# Altium schematic sheet Wacky_Racers_87557913.SchDoc
size A3; Address1: ECE Department; Address2: University of Canterbury; Address3: Christchurch 8041; Address4: New Zealand; Revision: 1; ImagePath: \\maxwell\elecapp\AltiumDesigner\Templates\uc-logo.png
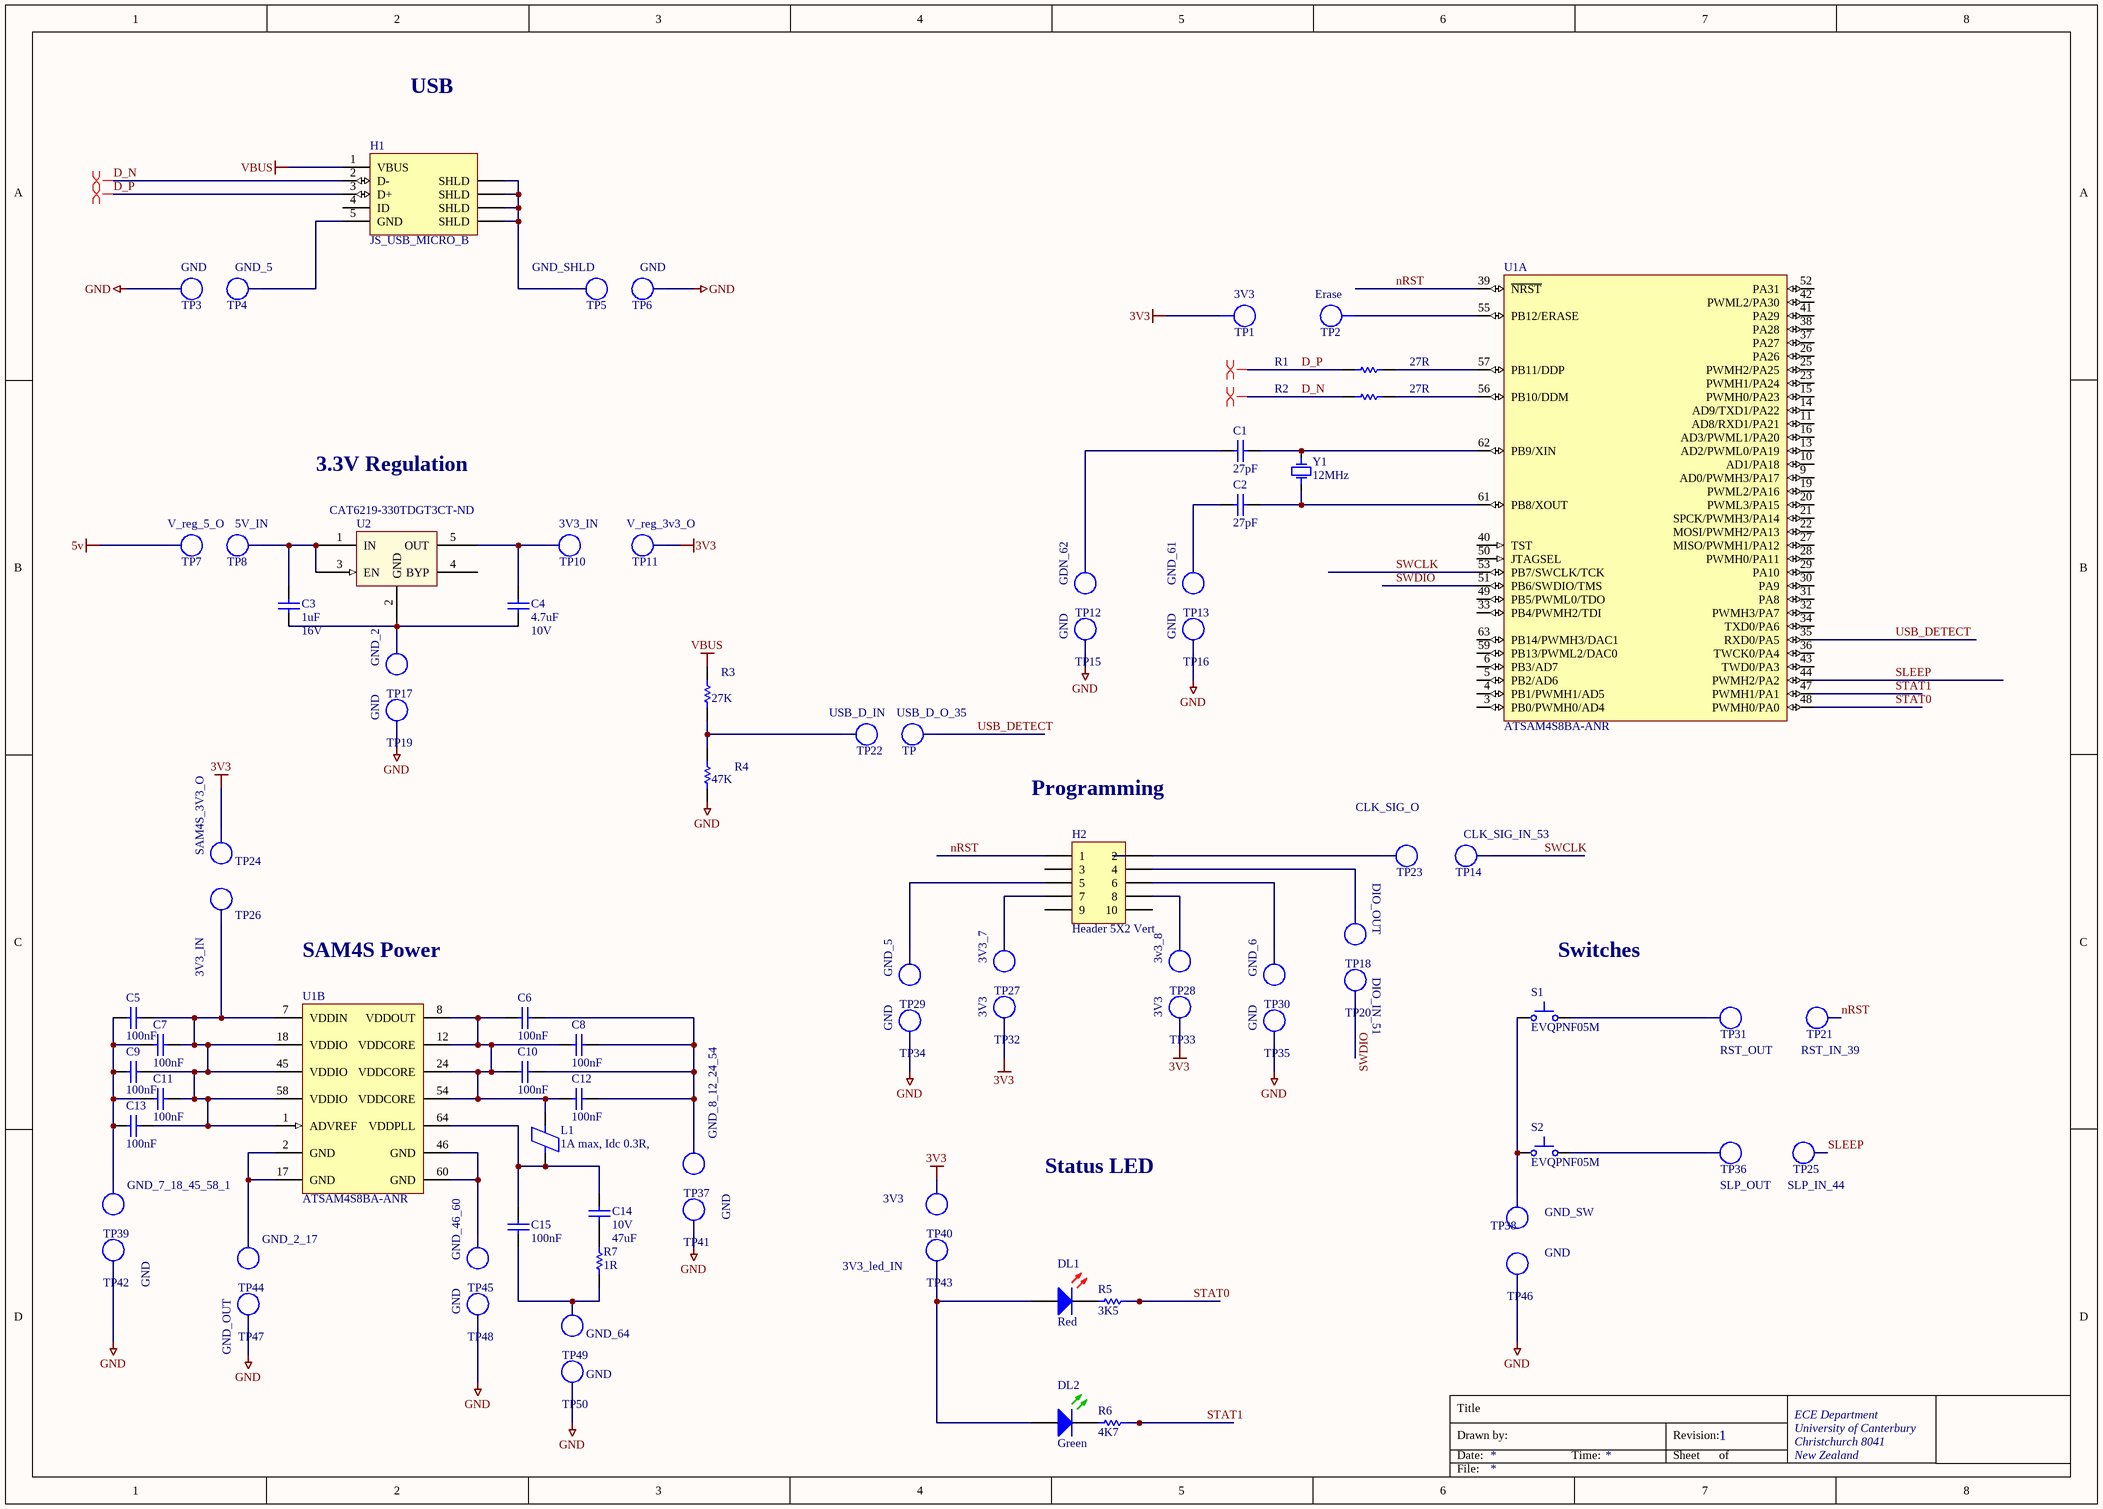
[diagram p0: Wacky_Racers_87557913.SchDoc]

## Parts
C1  27pF  [CAPC1608L]
C2  27pF  [CAPC1608L]
C3  Max Voltage: 16V  [CAPC1608L]  (hidden comment: 1uF)
C4  Max Voltage: 10V  [CAPC1608N]  (hidden comment: 4.7uF)
C5  100nF  [CAPC1608L]
C6  100nF  [CAPC1608L]
C7  100nF  [CAPC1608L]
C8  100nF  [CAPC1608L]
C9  100nF  [CAPC1608L]
C10  100nF  [CAPC1608L]
C11  100nF  [CAPC1608L]
C12  100nF  [CAPC1608L]
C13  100nF  [CAPC1608L]
C14  Max Voltage: 10V  [CAPC3216L]  (hidden comment: 47uF)
C15  100nF  [CAPC1608L]
DL1  Red  [WL-SMCW0603]
DL2  Green  [WL-SMCW0603]
H1  JS_USB_MICRO_B  [FCI_USB_10118194-0001LF]
H2  Header 5X2 Vert  [IDC2.54-V10D]
L1  1A max, Idc 0.3R,  [INDC3216L]
R1  27R  [RESC1608L]
R2  27R  [RESC1608L]
R3  27K  [RESC1608L]
R4  47K  [RESC1608N]
R5  3K5  [RESC1608L]
R6  4K7  [RESC1608L]
R7  1R  [RESC3216L]
S1  EVQPNF05M  [EVQPNF05M]
S2  EVQPNF05M  [EVQPNF05M]
TP  TP_0603  [TP_0603]  (value not drawn)
TP1  TP  [TP_1206]  (value not drawn)  (no BOM)
TP2  TP  [TP_1206]  (value not drawn)  (no BOM)
TP3  TP_0603  [TP_0603]  (value not drawn)
TP4  TP_0603  [TP_0603]  (value not drawn)
TP5  TP_0603  [TP_0603]  (value not drawn)
TP6  TP_0603  [TP_0603]  (value not drawn)
TP7  TP_0603  [TP_0603]  (value not drawn)
TP8  TP_0603  [TP_0603]  (value not drawn)
TP10  TP_0603  [TP_0603]  (value not drawn)
TP11  TP_0603  [TP_0603]  (value not drawn)
TP12  TP_0603  [TP_0603]  (value not drawn)
TP13  TP_0603  [TP_0603]  (value not drawn)
TP14  TP_0603  [TP_0603]  (value not drawn)
TP15  TP_0603  [TP_0603]  (value not drawn)
TP16  TP_0603  [TP_0603]  (value not drawn)
TP17  TP_0603  [TP_0603]  (value not drawn)
TP18  TP_0603  [TP_0603]  (value not drawn)
TP19  TP_0603  [TP_0603]  (value not drawn)
TP20  TP_0603  [TP_0603]  (value not drawn)
TP21  TP_0603  [TP_0603]  (value not drawn)
TP22  TP_0603  [TP_0603]  (value not drawn)
TP23  TP_0603  [TP_0603]  (value not drawn)
TP24  TP_0603  [TP_0603]  (value not drawn)
TP25  TP_0603  [TP_0603]  (value not drawn)
TP26  TP_0603  [TP_0603]  (value not drawn)
TP27  TP_0603  [TP_0603]  (value not drawn)
TP28  TP_0603  [TP_0603]  (value not drawn)
TP29  TP_0603  [TP_0603]  (value not drawn)
TP30  TP_0603  [TP_0603]  (value not drawn)
TP31  TP_0603  [TP_0603]  (value not drawn)
TP32  TP_0603  [TP_0603]  (value not drawn)
TP33  TP_0603  [TP_0603]  (value not drawn)
TP34  TP_0603  [TP_0603]  (value not drawn)
TP35  TP_0603  [TP_0603]  (value not drawn)
TP36  TP_0603  [TP_0603]  (value not drawn)
TP37  TP_0603  [TP_0603]  (value not drawn)
TP38  TP_0603  [TP_0603]  (value not drawn)
TP39  TP_0603  [TP_0603]  (value not drawn)
TP40  TP_0603  [TP_0603]  (value not drawn)
TP41  TP_0603  [TP_0603]  (value not drawn)
TP42  TP_0603  [TP_0603]  (value not drawn)
TP43  TP_0603  [TP_0603]  (value not drawn)
TP44  TP_0603  [TP_0603]  (value not drawn)
TP45  TP_0603  [TP_0603]  (value not drawn)
TP46  TP_0603  [TP_0603]  (value not drawn)
TP47  TP_0603  [TP_0603]  (value not drawn)
TP48  TP_0603  [TP_0603]  (value not drawn)
TP49  TP_0603  [TP_0603]  (value not drawn)
TP50  TP_0603  [TP_0603]  (value not drawn)
U1  ATSAM4S8BA-ANR  [LQFP64_L]  (parts A,B of 2)
U2  Supplier Part Number: CAT6219-330TDGT3CT-ND  [SOT95P280X145-5N]  (hidden comment: CAT6219-330TDGT3)
Y1  12MHz  [6.0X3.5-4]

## Nets
3V3: TP1.1 TP11.1(TP) TP24.1(TP) TP32.1(TP) TP33.1(TP) TP40.1(TP)
5v: TP7.1(TP)
GND: R4.1 TP3.1(TP) TP6.1(TP) TP15.1(TP) TP16.1(TP) TP19.1(TP) TP34.1(TP) TP35.1(TP) TP41.1(TP) TP42.1(TP) TP46.1(TP) TP47.1(TP) TP48.1(TP) TP50.1(TP)
VBUS: H1.1(VBUS) R3.2
D_N: H1.2(D-) R2.1
D_P: H1.3(D+) R1.1
nRST: H2.1 TP21.1(TP) U1.39(~{NRST})
SLEEP: TP25.1(TP) U1.44(PWMH2/PA2)
STAT0: R5.2 U1.48(PWMH0/PA0)
STAT1: R6.2 U1.47(PWMH1/PA1)
SWCLK: TP14.1(TP) U1.53(PB7/SWCLK/TCK)
SWDIO: TP20.1(TP) U1.51(PB6/SWDIO/TMS)
USB_DETECT: TP.1(TP) U1.35(RXD0/PA5)
NetC1_1: C1.1 TP12.1(TP)
NetC1_2: C1.2 U1.62(PB9/XIN) Y1.3(OSC2)
NetC2_1: C2.1 TP13.1(TP)
NetC2_2: C2.2 U1.61(PB8/XOUT) Y1.1(OSC1)
NetC3_1: C3.1 C4.1 TP17.1(TP) U2.2(GND)
NetC3_2: C3.2 TP8.1(TP) U2.1(IN) U2.3(EN)
NetC4_2: C4.2 TP10.1(TP) U2.5(OUT)
NetC5_1: C5.1 C7.1 C9.1 C11.1 C13.2 TP39.1(TP)
NetC5_2: C5.2 C7.2 C9.2 C11.2 C13.1 TP26.1(TP) U1.1(ADVREF) U1.7(VDDIN) U1.18(VDDIO) U1.45(VDDIO) U1.58(VDDIO)
NetC6_1: C6.1 C8.1 C10.1 C12.1 L1.2 U1.8(VDDOUT) U1.12(VDDCORE) U1.24(VDDCORE) U1.54(VDDCORE)
NetC6_2: C6.2 C8.2 C10.2 C12.2 TP37.1(TP)
NetC14_1: C14.1 R7.2
NetC14_2: C14.2 C15.2 L1.1 U1.64(VDDPLL)
NetC15_1: C15.1 R7.1 TP49.1(TP)
NetDL1_2: DL1.2(A) DL2.2(A) TP43.1(TP)
NetH1_5: H1.5(GND) TP4.1(TP)
NetH1_6: H1.6(SHLD) TP5.1(TP)
NetH2_2: H2.2 TP23.1(TP)
NetH2_4: H2.4 TP18.1(TP)
NetH2_5: H2.5 TP29.1(TP)
NetH2_6: H2.6 TP30.1(TP)
NetH2_7: H2.7 TP27.1(TP)
NetH2_8: H2.8 TP28.1(TP)
NetR1_2: R1.2 U1.57(PB11/DDP)
NetR2_2: R2.2 U1.56(PB10/DDM)
NetR3_1: R3.1 R4.2 TP22.1(TP)
NetS1_1: S1.1 S2.1 TP38.1(TP)
NetS1_2: S1.2 TP31.1(TP)
NetS2_2: S2.2 TP36.1(TP)
NetTP2_1: TP2.1 U1.55(PB12/ERASE)
NetTP44_1: TP44.1(TP) U1.2(GND) U1.17(GND)
NetTP45_1: TP45.1(TP) U1.46(GND) U1.60(GND)

Not connected (* = marked no-connect by the designer): DL1 1(K); DL2 1(K); H1 4(ID); H2 3 9 10; R5 1; R6 1; U1 3(PB0/PWMH0/AD4) 4(PB1/PWMH1/AD5) 5(PB2/AD6) 6(PB3/AD7) 9(AD0/PWMH3/PA17) 10(AD1/PA18) 11(AD8/RXD1/PA21) 13(AD2/PWML0/PA19) 14(AD9/TXD1/PA22) 15(PWMH0/PA23) 16(AD3/PWML1/PA20) 19(PWML2/PA16) 20(PWML3/PA15) 21(SPCK/PWMH3/PA14) 22(MOSI/PWMH2/PA13) 23(PWMH1/PA24) 25(PWMH2/PA25) 26(PA26) 27(MISO/PWMH1/PA12) 28(PWMH0/PA11) 29(PA10) 30(PA9) 31(PA8) 32(PWMH3/PA7) 33(PB4/PWMH2/TDI) 34(TXD0/PA6) 36(TWCK0/PA4) 37(PA27) 38(PA28) 40(TST) 41(PA29) 42(PWML2/PA30) 43(TWD0/PA3) 49(PB5/PWML0/TDO) 50(JTAGSEL) 52(PA31) 59(PB13/PWML2/DAC0) 63(PB14/PWMH3/DAC1); U2 4(BYP)

## Layout directives
differential pair: D_N, D_P

## Notes on the sheet
- USB
- (near TP3) GND
- (near TP4) GND_5
- (near TP5) GND_SHLD
- (near TP6) GND
- (near TP1) 3V3
- (near TP2) Erase
- 3.3V Regulation
- (near TP7) V_reg_5_O
- (near TP8) 5V_IN
- (near TP10) 3V3_IN
- (near TP11) V_reg_3v3_O
- (near TP12) GDN_62
- (near TP13) GND_61
- (near TP15) GND
- (near TP16) GND
- (near TP19) GND
- (near TP17) GND_2
- (near TP22) USB_D_IN
- (near TP) USB_D_O_35
- (near TP24) SAM4S_3V3_O
- Programming
- (near TP23) CLK_SIG_O
- (near TP14) CLK_SIG_IN_53
- (near TP18) DIO_OUT
- (near TP26) 3V3_IN
- SAM4S Power
- (near TP29) GND_5
- (near TP27) 3V3_7
- (near TP28) 3v3_8
- (near TP30) GND_6
- (near TP20) DIO_IN_51
- Switches
- (near TP34) GND
- (near TP32) 3V3
- (near TP33) 3V3
- (near TP35) GND
- (near TP31) RST_OUT
- (near TP21) RST_IN_39
- (near TP39) GND_7_18_45_58_1
- (near TP37) GND_8_12_24_54
- Status LED
- (near TP36) SLP_OUT
- (near TP25) SLP_IN_44
- (near TP44) GND_2_17
- (near TP45) GND_46_60
- (near TP41) GND
- (near TP40) 3V3
- (near TP38) GND_SW
- GND
- (near TP42) GND
- (near TP48) GND
- (near TP43) 3V3_led_IN
- (near TP47) GND_OUT
- (near TP50) GND
- (near TP49) GND_64
- Title
- Drawn by:
- Date:
- Time:
- Revision:
- Sheet
- of
- File:

## Library data of the parts
C1 C2 = CC_27pF_0603: CAP CER 27pF NPO/COG +-5% 50V 0603; PackageReference: 0603; Code_IPC: 1608 [0603]; Verify: *; Supplier: ECE Dept; Storage Location: PCB Assembly WS; Value: 27pF
C3 = CC_1uF_0603: CAP CER 1uF Y5V -20% +80% 16V 0603; PackageReference: 0603; Code_IPC: 1608 [0603]; Verify: *; Supplier: ECE Dept; Storage Location: PCB Assembly WS; Value: 1uF
C4 = CC_4.7uF_0603: CAP CER 4.7uF X5R +-20%  10V 0603; Note: Footprint corresponds to dimensions for bulk cassette packaging. This case size has tightened tolerances.; PackageReference: 0805; Code_IPC: 2012[0805]; Verify: *; Supplier: ECE Dept; Storage Location: PCB Assembly WS; Value: 4.7uF
C5-C13 C15 = CC_100nF_0603: CAP CER 100nF X7R +-10% 50V 0603; PackageReference: 0603; Code_IPC: 1608 [0603]; Verify: *; Supplier: ECE Dept; Storage Location: PCB Assembly WS; Value: 100nF
C14 = CC_47uF_1206: CAP CER 47uF X5R -/+20% 10V 1206; Verify: *; Supplier: ECE Dept; Storage Location: PCB Assembly WS; Dielectric: X5R; Footprint: 1210 (3225 metric); MoV: 10V; Value: 47uF
DL1 = DL_150060RS75000: LED Red 250mcd 0603 SMD; Manufacturer: WURTH ELEKTRONIK; Forward Current If: 30; Forward Voltage: 2; Lens Shape: Rectangular; Luminous Intensity: 250; Wavelength Typ: 625; Viewing Angle: 140°; LED Mounting: SMD; Supplier 1: Farnell; Supplier Part Number 1: 2322071; Manufacturer Part Number: 150060RS75000; Storage Location: PCB Assembly WS; Supplier: ECE Dept; LED Colour: Red
DL2 = DL_150060GS75000: LED Green 430mcd 0603 SMD; Manufacturer: WURTH ELEKTRONIK; Forward Current If: 30; Wavelength Typ: 520; Forward Voltage: 3.2; Lens Shape: Rectangular; Luminous Intensity: 430; Viewing Angle: 140°; LED Mounting: SMD; Supplier 1: Farnell; Supplier Part Number 1: 2322070; Manufacturer Part Number: 150060GS75000; Storage Location: PCB Assembly WS; Supplier: ECE Dept; LED Colour: Green
H1 = JS_USB_MICRO_B_SMT: CONN USB MICRO B RECPT SMT R/A; Manufacturer: FCI; Manufacturer Part Number: 10118194-0001LF; Gender: Receptacle; Number of Contacts: 5; Specifications: USB 2.0; Supplier 1: Digi-Key; Supplier Part Number 1: 609-4618-1-ND; Features: Shielded, Solder Retention; Mounting Type: Surface Mount, Right Angle, Horizontal
H2 = JA_HDR_IDC_5X2_VERT: IDC Header, 2,54mm, 10-Pin, Vert; Supplier: ECE Dept; Supplier 1: Farnell; Supplier Part Number 1: 1096985; Storage Location: ECE Dept Store
L1 = IN_Ferrite-Bead: Ferrite Bead, Rdc 0.3R, Z100MHZ 600R, Imax 1A, SMD 1206; Manufacturer: FAIR-RITE; Manufacturer PN: 2512066017Y1; DC Current Rating: 1; DC Resistance Max: 0.08; Ferrite Case Style: 1206 ^3216 Metric]; Frequency Range: 50MHz to 1; Impedance: 600; Impedance Tolerance: ± 25%; Supplier: ECE Dept; Storage Location: PCB Assembly WS; Ferrite Mounting: SMD; Supplier 1: Farnell; Supplier Part Number 1: 1612060; Manufacturer Part Number: 2512066017Y1; Value: 1A max, Idc 0.3R,
R1 R2 = RS_27R: RES 27 OHM 1/10W 5% 0603 SMD; Storage Location: PCB Assembly WS; Supplier: ECE Dept; Value: 27R
R3 = RS_27K: RES 27K OHM 1/10W 5% 0603 SMD; Storage Location: PCB Assembly WS; Supplier: ECE Dept; Value: 27K
R4 = RS_47K: RES 47.0K OHM 1/10W 5% 0603 SMD; Storage Location: PCB Assembly WS; Supplier: ECE Dept; Value: 47K
R5 R6 = RS_4K7: RES 4.7K OHM 1/10W 5% 0603 SMD; Storage Location: PCB Assembly WS; Supplier: ECE Dept
  R5: Value: 3K5
  R6: Value: 4K7
R7 = RT_1R: RES 1R OHM 1/4W 5% 1206 SMD; Storage Location: PCB Assembly WS; Supplier: ECE Dept; Value: 1R
S1 S2 = WS_EVQPNF05M: Panasonic 6 x 3.5mm SMD Light Touch Switch Type SMD; PackageDescription: 6.0 x 3.5 mm; Supplier 1: Farnell; Supplier Part Number 1: 2079481; Manufacturer: Panasonic; Manufacturer PN: EVQPNF05M; Supplier 2: Digi-Key; Supplier Part Number 2: P13598SCT-ND; Storage Location: PCB Assembly WS; Supplier: ECE Dept
TP TP3-TP8 TP10-TP50 = TP_0603: Test Point 1.65X0.9X1.2mm SMD; Manufacturer: TE Connectivity AMP Connectors; Manufacturer Part Number: 1625854-3; Supplier 1: Digi-Key; Mounting Type: Surface Mount; Terminal: 0.063" x 0.031" x 0.045" (1.60mm x 0.80mm x 1.15mm); Type: PC Test Point; Supplier Part Number 1: A106145CT-ND
TP1 TP2 = TP_1206: Test-Point 3.3x1.6x2.1mm SMD; Manufacturer: Harwin Inc; Manufacturer Part Number: S1751-46R; Manufacturer PN: *; Storage Location: ProtoPlace; Mounting Type: Surface Mount; Type: PC Test Point; Supplier 1: Digi-Key; Supplier Part Number 1: 952-1478-2-ND; Supplier 2: Farnell; Supplier Part Number 2: 1826282; Supplier: ECE Dept; Value: TP
U1 = SE_ATSAM4S16BA-MU: IC MCU 32BIT 512KB FLASH 64LQFP; Manufacturer: Atmel; Connectivity: I²C, IrDA, Memory Card, SPI, SSC, UART/USART, USB; Core Processor: ARM® Cortex®-M4; Core Size: 32-Bit; Data Converters: A/D 11x12b, D/A 2x12b; Number of I/O: 47; Peripherals: Brown-out Detect/Reset, DMA, POR, PWM, WDT; Program Memory Size: 512KB (512K x 8); RAM Size: 128K x 8; Speed: 120MHz; Voltage - Supply (Vcc/Vdd): 1.62 V ~ 3.6 V; PackageVersion: revJ, Jul-2007; PackageReference: 64PS; PackageDescription: 64-Pin Quad Flat No-Lead (QFN) Sawn, 9 x 9 x 1.0 mm Body, 0.5 mm Pitch, Exposed Pad; Code_JEDEC: MO-220VMMD-3; ComponentLink1Description: Manufacturer URL; ComponentLink1URL: http://www.atmel.com/; ComponentLink2Description: SAM4S Series Datasheet; ComponentLink2URL: http://www.atmel.com/dyn/resources/prod_documents/11100.pdf; ComponentLink3Description: SAM4S Series Summary; ComponentLink3URL: http://www.atmel.com/dyn/resources/prod_documents/11100S.pdf; Supplier 1: Digi-Key; Package / Case: 64-LQFP; Packaging: Cut Tape (CT); Program Memory Type: FLASH; Supplier Part Number 1: ATSAM4S8BA-ANRCT-ND; Manufacturer Part Number: ATSAM4S8BA-ANR
U2 = SV_CAT6219-330TDGT3: IC REG LIN 3.3V 500MA TSOT23-5; Voltage - Input (Max): 5.5V; Voltage Dropout (Max): 0.5V @ 500mA; Manufacturer Part Number: CAT6219-330TDGT3; Base Part Number: CAT6219; Current - Output: 500mA; Package / Case: SOT-23-5 Thin, TSOT-23-5; Supplier: Digi-Key; Supplier Device Package: TSOT-23-5; Voltage - Output (Min/Fixed): 3.3V; ComponentLink1URL: http://www.onsemi.com/pub/Collateral/CAT6219-D.PDF; ComponentLink1Description: http://www.onsemi.com/pub/Collateral/CAT6219-D.PDF; Supplier 1: Digi-Key; ComponentLink2Description: CAT6219 Datasheet; ComponentLink2URL: \\maxwell\elecapp\AltiumDesigner\Libraries\DatasheetsNew\ENCE461\CAT6219-D.PDF
Y1 = XT_CRYSTAL_12MHz_18pF: CRYSTAL 12MHZ 18PF 6X3.5mm SMD; Manufacturer: CTS-Frequency Controls; Manufacturer Part Number: 406C35D12M00000; ESR (Equivalent Series Resistance): 60 Ohm; Frequency Stability: ±50ppm; Frequency Tolerance: ±30ppm; Operating Mode: Fundamental; Supplier 1: Digi-Key; Height: 0.047" (1.20mm); Load Capacitance: 18pF; Mounting Type: Surface Mount; Operating Temperature: -20°C ~ 70°C; Package / Case: 4-SMD, No Lead (DFN, LCC); Size / Dimension: 0.236" L x 0.138" W (6.00mm x 3.50mm); Supplier Part Number 1: CTX855CT-ND; Frequency: 12MHz